# Altium schematic sheet io_expander.SchDoc: SPI I/O Expander
size A; Organization: UCLA HEP; DocumentNumber: 12; Revision: 2.0; SheetNumber: 12; SheetTotal: 14
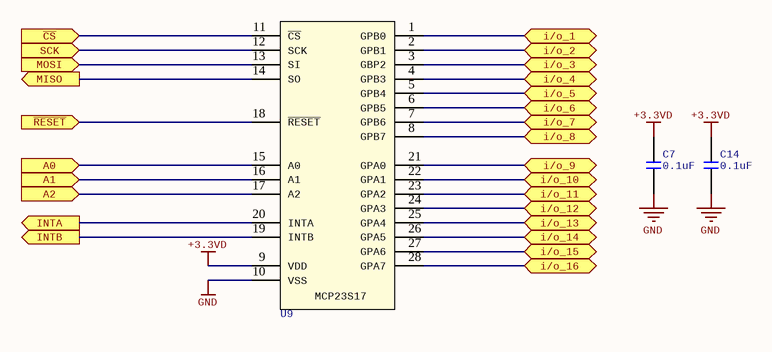
[diagram p0: io_expander.SchDoc]

## Parts
C7  0.1uF  [C0603]
C14  0.1uF  [C0603]
U9  MCP23S17T  [SSOP-28]  (value not drawn)

## Ports
A0 (in), A1 (in), A2 (in), i/o_1 (bidir), i/o_2 (bidir), i/o_3 (bidir), i/o_4 (bidir), i/o_5 (bidir), i/o_6 (bidir), i/o_7 (bidir), i/o_8 (bidir), i/o_9 (bidir), i/o_10 (bidir), i/o_11 (bidir), i/o_12 (bidir), i/o_13 (bidir), i/o_14 (bidir), i/o_15 (bidir), i/o_16 (bidir), INTA (out), INTB (out), MISO (out), MOSI (in), SCK (in), ~{CS} (in), ~{RESET} (in)

## Nets
+3.3VD: C7.2 C14.2 U9.9(VDD)
GND: C7.1 C14.1 U9.10(VSS)
A0: U9.15(A0) ; port A0
A1: U9.16(A1) ; port A1
A2: U9.17(A2) ; port A2
~{CS}: U9.11(~{CS}) ; port ~{CS}
i/o_1: U9.1(GPB0) ; port i/o_1
i/o_2: U9.2(GPB1) ; port i/o_2
i/o_3: U9.3(GBP2) ; port i/o_3
i/o_4: U9.4(GPB3) ; port i/o_4
i/o_5: U9.5(GPB4) ; port i/o_5
i/o_6: U9.6(GPB5) ; port i/o_6
i/o_7: U9.7(GPB6) ; port i/o_7
i/o_8: U9.8(GPB7) ; port i/o_8
i/o_9: U9.21(GPA0) ; port i/o_9
i/o_10: U9.22(GPA1) ; port i/o_10
i/o_11: U9.23(GPA2) ; port i/o_11
i/o_12: U9.24(GPA3) ; port i/o_12
i/o_13: U9.25(GPA4) ; port i/o_13
i/o_14: U9.26(GPA5) ; port i/o_14
i/o_15: U9.27(GPA6) ; port i/o_15
i/o_16: U9.28(GPA7) ; port i/o_16
INTA: U9.20(INTA) ; port INTA
INTB: U9.19(INTB) ; port INTB
MISO: U9.14(SO) ; port MISO
MOSI: U9.13(SI) ; port MOSI
~{RESET}: U9.18(~{RESET}) ; port ~{RESET}
SCK: U9.12(SCK) ; port SCK

## Notes on the sheet
- Size:
- A
- Revision:
- Date:
- Sheet
- of
- (in symbol Microchip/MCP23S17T-E/SS) MCP23S17

## Library data of the parts
C7 C14 = VJ0603Y104KXXAC00: CAP2, CER, 0.1uF, 10%, 25V, 0603
U9 = Microchip/MCP23S17T-E/SS: CMOS, IC I/O EXPANDER SPI 16B 28SSOP; Manufacturer: Microchip Technology; Number of I/O: 16; Interrupt Output: Yes; Output Type: Push-Pull; Current - Output Source/Sink: 25mA; Frequency - Clock: 10MHz; Voltage - Supply: 1.8 V ~ 5.5 V; Supplier 1: Digi-Key; Manufacturer Part Number: MCP23S17T-E/SS; RoHS: RoHS Compliant; Category: Integrated Circuits (ICs); Stock 1: 2427; Pricing 1: 1=1.58, 10=1.32, 25=1.1, 100=1 (USD); Packaging: Cut Tape (CT); Interface: SPI; Features: -; Operating Temperature: -40°C ~ 125°C; Mounting Type: Surface Mount; Package / Case: 28-SSOP (0.209", 5.30mm Width); Supplier Device Package: 28-SSOP; ComponentLink1URL: http://www.microchip.com/mymicrochip/filehandler.aspx?ddocname=en023709; ComponentLink1Description: http://www.microchip.com/mymicrochip/filehandler.aspx?ddocname=en023709; Supplier Part Number 1: MCP23S17T-E/SSCT-ND